# Altium project MPPT.PrjPcb
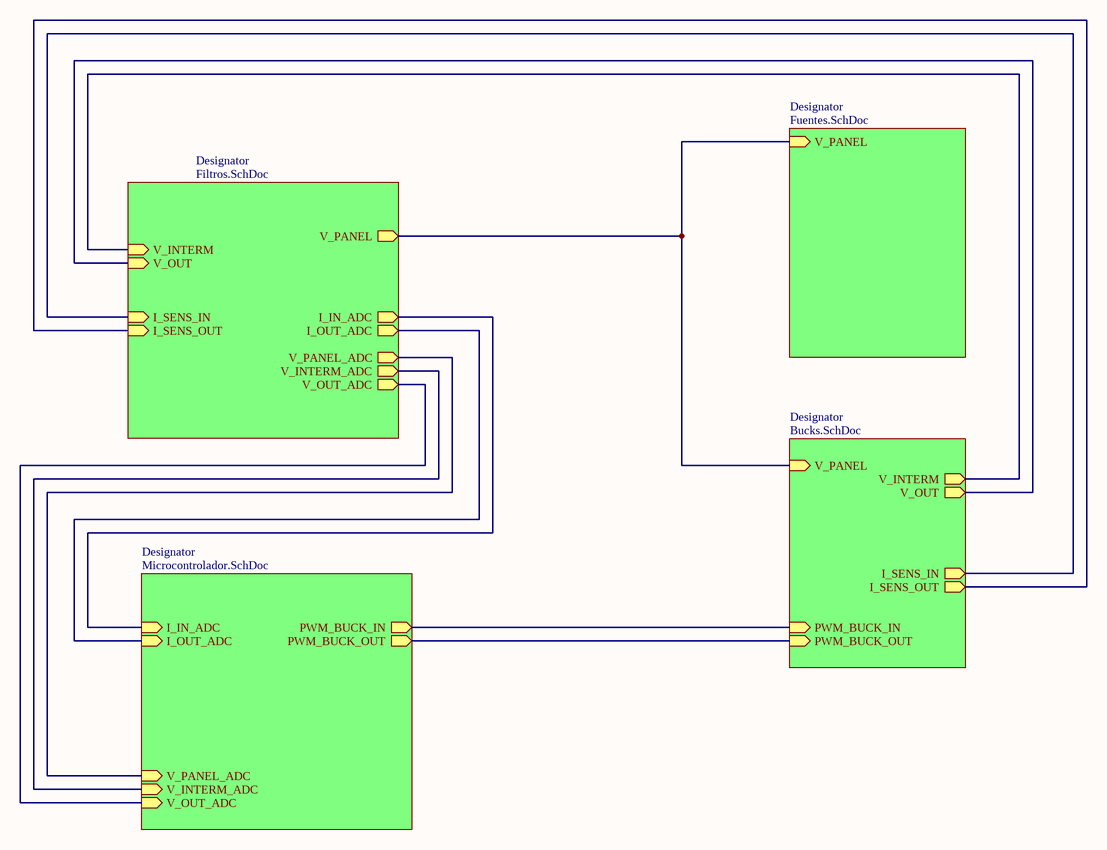
[diagram p0: MainSCH.SchDoc]
5 sheets, 93 parts. Net scope: hierarchical (ports join the sheet entries above them; power ports are global).
Board file: PCB_MPPT_V1.0.PcbDoc
Sheets:
  MainSCH.SchDoc
    Designator = Bucks.SchDoc
    Designator = Filtros.SchDoc
    Designator = Fuentes.SchDoc
    Designator = Microcontrolador.SchDoc

## Sheet MainSCH.SchDoc
size A4; SheetNumber: 1; SheetTotal: 5

### Sub-sheets
Designator = Bucks.SchDoc: V_PANEL (in), V_INTERM (out), PWM_BUCK_OUT (in), PWM_BUCK_IN (in), V_OUT (out), I_SENS_IN (out), I_SENS_OUT (out)
Designator = Filtros.SchDoc: I_SENS_IN (in), I_SENS_OUT (in), V_INTERM (in), V_OUT (in), V_PANEL (out), I_IN_ADC (out), I_OUT_ADC (out), V_PANEL_ADC (out), V_INTERM_ADC (out), V_OUT_ADC (out)
Designator = Fuentes.SchDoc: V_PANEL (in)
Designator = Microcontrolador.SchDoc: I_IN_ADC (in), I_OUT_ADC (in), V_PANEL_ADC (in), V_INTERM_ADC (in), PWM_BUCK_IN (out), PWM_BUCK_OUT (out), V_OUT_ADC (in)

### Nets
V_INTERM: sheet Designator/V_INTERM, sheet Designator/V_INTERM
V_OUT: sheet Designator/V_OUT, sheet Designator/V_OUT
V_PANEL: sheet Designator/V_PANEL, sheet Designator/V_PANEL, sheet Designator/V_PANEL
NetC12_1: sheet Designator/I_IN_ADC, sheet Designator/I_IN_ADC
NetC13_1: sheet Designator/I_OUT_ADC, sheet Designator/I_OUT_ADC
NetC15_1: sheet Designator/V_PANEL_ADC, sheet Designator/V_PANEL_ADC
NetC16_1: sheet Designator/V_INTERM_ADC, sheet Designator/V_INTERM_ADC
NetC17_1: sheet Designator/V_OUT_ADC, sheet Designator/V_OUT_ADC
NetR7_2: sheet Designator/I_SENS_IN, sheet Designator/I_SENS_IN
NetR9_2: sheet Designator/I_SENS_OUT, sheet Designator/I_SENS_OUT
NetR24_1: sheet Designator/PWM_BUCK_IN, sheet Designator/PWM_BUCK_IN
NetR25_1: sheet Designator/PWM_BUCK_OUT, sheet Designator/PWM_BUCK_OUT

## Sheet Bucks.SchDoc
size A4; SheetNumber: 2; SheetTotal: 5
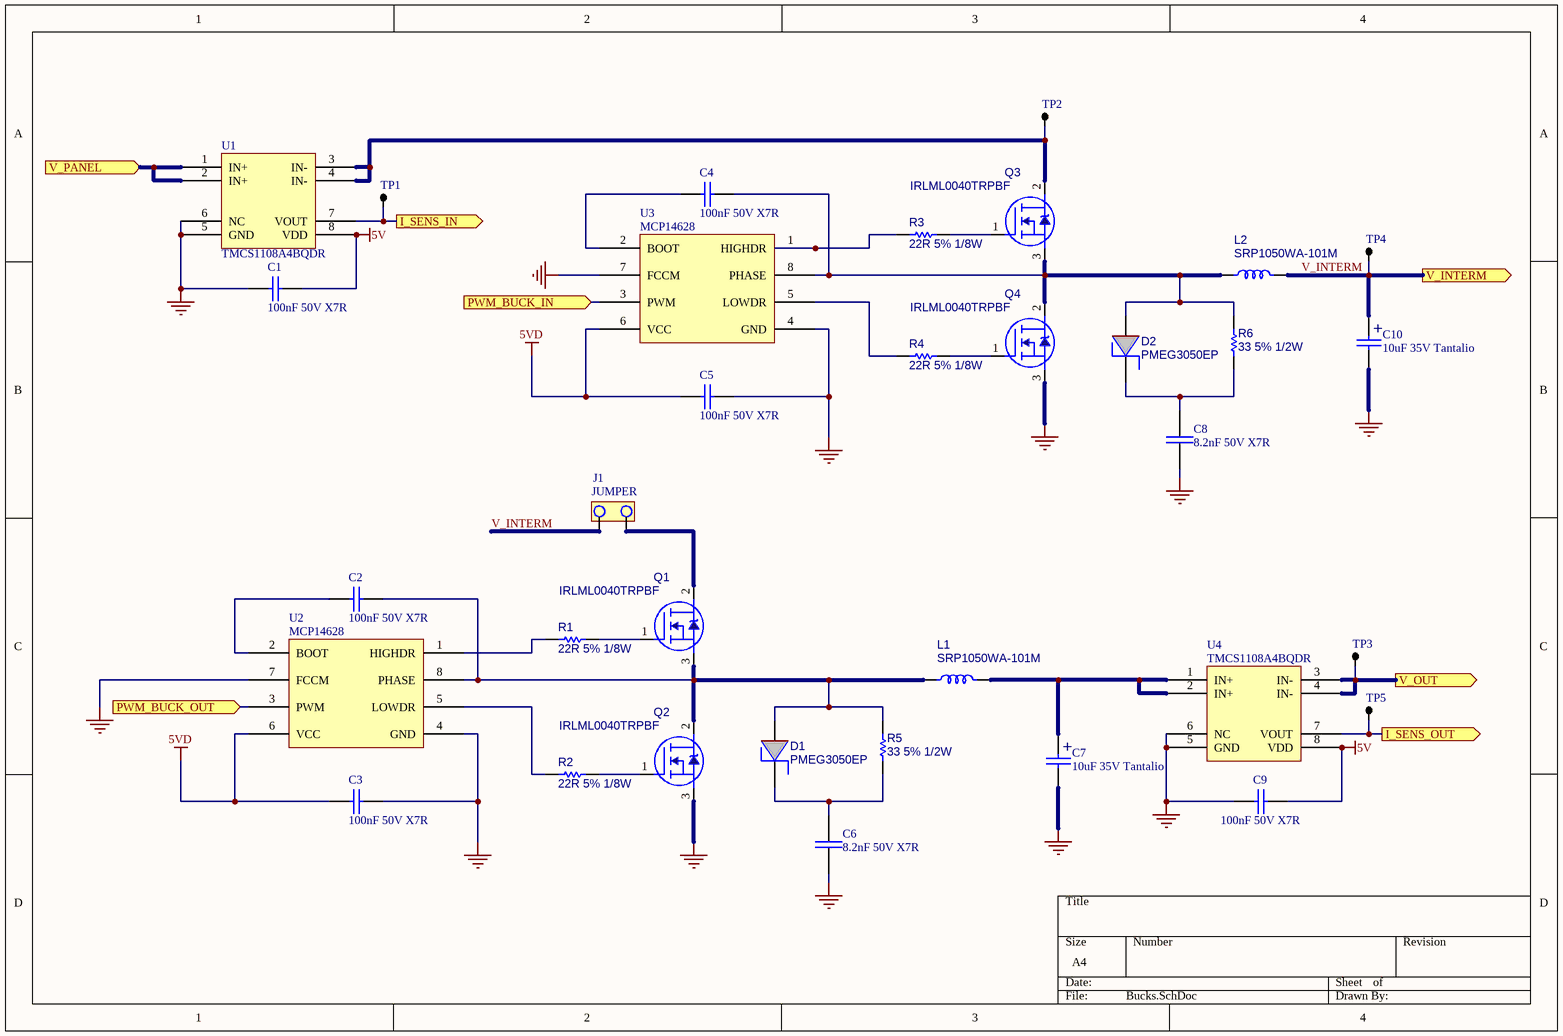
[diagram p1: Bucks.SchDoc]

### Parts
C1  100nF 50V X7R  [0805]
C2  100nF 50V X7R  [0805]
C3  100nF 50V X7R  [0805]
C4  100nF 50V X7R  [0805]
C5  100nF 50V X7R  [0805]
C6  8.2nF 50V X7R  [0805]
C7  10uF 35V Tantalio  [CAPPOL1210]
C8  8.2nF 50V X7R  [0805]
C9  100nF 50V X7R  [0805]
C10  10uF 35V Tantalio  [CAPPOL1210]
D1  PMEG3050EP  [SOD-128]
D2  PMEG3050EP  [SOD-128]
J1  JUMPER  [0805]
L1  SRP1050WA-101M  [SRP1050WA]
L2  SRP1050WA-101M  [SRP1050WA]
Q1  IRLML0040TRPBF  [DPAK]
Q2  IRLML0040TRPBF  [DPAK]
Q3  IRLML0040TRPBF  [DPAK]
Q4  IRLML0040TRPBF  [DPAK]
R1  22R 5% 1/8W  [0805]
R2  22R 5% 1/8W  [0805]
R3  22R 5% 1/8W  [0805]
R4  22R 5% 1/8W  [0805]
R5  33 5% 1/2W  [1206]
R6  33 5% 1/2W  [1206]
TP1  TP  [TP_COMPACT]  (value not drawn)
TP2  TP  [TP_COMPACT]  (value not drawn)
TP3  TP  [TP_COMPACT]  (value not drawn)
TP4  TP  [TP_COMPACT]  (value not drawn)
TP5  TP  [TP_COMPACT]  (value not drawn)
U1  TMCS1108A4BQDR  [SO8]
U2  MCP14628  [SO8]
U3  MCP14628  [SO8]
U4  TMCS1108A4BQDR  [SO8]

### Ports
I_SENS_IN (out, see MainSCH[4C], Filtros[1B]), I_SENS_OUT (out, see MainSCH[4C], Filtros[1C]), PWM_BUCK_IN (in, see MainSCH[3C], Microcontrolador[4A]), PWM_BUCK_OUT (in, see MainSCH[3C], Microcontrolador[4B]), V_INTERM (out, see MainSCH[4C], Filtros[2C]), V_OUT (out, see MainSCH[4C], Filtros[3B]), V_PANEL (in, see MainSCH[3C], Filtros[2A], Fuentes[1B])

### Nets
5V: C1.1 C9.1 U1.8(VDD) U4.8(VDD)
5VD: C3.2 C5.2 U2.6(VCC) U3.6(VCC)
GND: C1.2 C3.1 C5.1 C6.2 C7.2 C8.2 C9.2 C10.2 Q2.3(SOURCE) Q4.3(SOURCE) U1.5(GND) U1.6(NC) U2.4(GND) U2.7(FCCM) U3.4(GND) U3.7(FCCM) U4.5(GND) U4.6(NC)
V_INTERM: C10.1 J1.2 L2.2 TP4.1 ; port V_INTERM
V_OUT: TP3.1 U4.3(IN-) U4.4(IN-) ; port V_OUT
V_PANEL: U1.1(IN+) U1.2(IN+) ; port V_PANEL
NetC2_1: C2.1 D1.1(A) L1.1 Q1.3(SOURCE) Q2.2(DRAIN) R5.2 U2.8(PHASE)
NetC2_2: C2.2 U2.2(BOOT)
NetC4_1: C4.1 D2.1(A) L2.1 Q3.3(SOURCE) Q4.2(DRAIN) R6.2 U3.8(PHASE)
NetC4_2: C4.2 U3.2(BOOT)
NetC6_1: C6.1 D1.2(K) R5.1
NetC7_1: C7.1 L1.2 U4.1(IN+) U4.2(IN+)
NetC8_1: C8.1 D2.2(K) R6.1
NetJ1_1: J1.1 Q1.2(DRAIN)
NetQ1_1: Q1.1(GATE) R1.1
NetQ2_1: Q2.1(GATE) R2.1
NetQ3_1: Q3.1(GATE) R3.1
NetQ3_2: Q3.2(DRAIN) TP2.1 U1.3(IN-) U1.4(IN-)
NetQ4_1: Q4.1(GATE) R4.1
NetR1_2: R1.2 U2.1(HIGHDR)
NetR2_2: R2.2 U2.5(LOWDR)
NetR3_2: R3.2 U3.1(HIGHDR)
NetR4_2: R4.2 U3.5(LOWDR)
NetR7_2: TP1.1 U1.7(VOUT) ; port I_SENS_IN
NetR9_2: TP5.1 U4.7(VOUT) ; port I_SENS_OUT
NetR24_1: U3.3(PWM) ; port PWM_BUCK_IN
NetR25_1: U2.3(PWM) ; port PWM_BUCK_OUT

### Notes on the sheet
- (in symbol CAPPOL) +

### Library data of the parts
C1-C5 C9 = CAP
C6 C8 = Ceramic capacitor
C7 C10 = CAPPOL: TCJB106M035R0200
D1 D2 = DIODO_SH: Diode Shottky
L1 L2 = IND: Inductor
Q1-Q4 = N_MOSFET_SOT23: Mosfet N-Ch
R1-R6 = Res1: Resistor
U1 U4 = TMCS1108: Supplier 1: Digi-Key; Supplier Part Number 1: 296-TMCS1108A4BQDRCT-ND

## Sheet Filtros.SchDoc: Electronica de Potencia
size A4; CompanyName: UTN FRBA; SheetNumber: 3; SheetTotal: 5
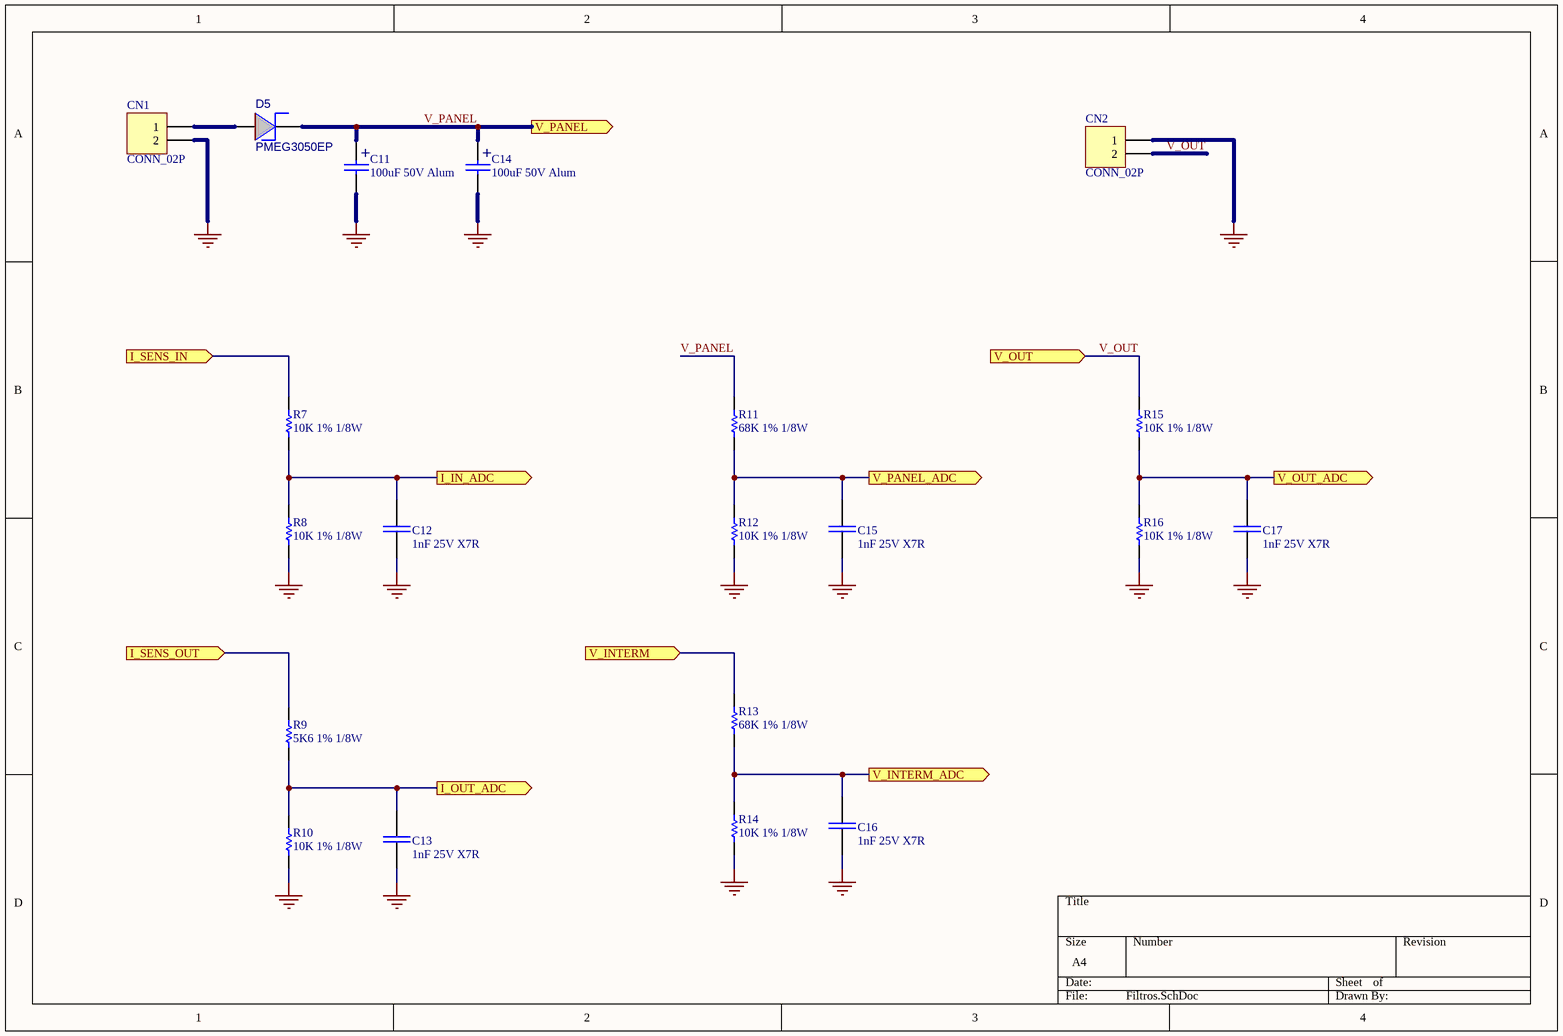
[diagram p2: Filtros.SchDoc]

### Parts
C11  100uF 50V Alum  [CAPSMD8x8.3]
C12  1nF 25V X7R  [0805]
C13  1nF 25V X7R  [0805]
C14  100uF 50V Alum  [CAPSMD8x8.3]
C15  1nF 25V X7R  [0805]
C16  1nF 25V X7R  [0805]
C17  1nF 25V X7R  [0805]
CN1  CONN_02P  [Bornera2_DegsonH]
CN2  CONN_02P  [Bornera2_DegsonH]
D5  PMEG3050EP  [SOD-128]
R7  10K 1% 1/8W  [0805]
R8  10K 1% 1/8W  [0805]
R9  5K6 1% 1/8W  [0805]
R10  10K 1% 1/8W  [0805]
R11  68K 1% 1/8W  [0805]
R12  10K 1% 1/8W  [0805]
R13  68K 1% 1/8W  [0805]
R14  10K 1% 1/8W  [0805]
R15  10K 1% 1/8W  [0805]
R16  10K 1% 1/8W  [0805]

### Ports
I_IN_ADC (out, see MainSCH[2B], Microcontrolador[3A]), I_OUT_ADC (out, see MainSCH[2B], Microcontrolador[3A]), I_SENS_IN (in, see MainSCH[2B], Bucks[2A]), I_SENS_OUT (in, see MainSCH[2B], Bucks[4C]), V_INTERM (in, see MainSCH[2B], Bucks[4B]), V_INTERM_ADC (out, see MainSCH[2B], Microcontrolador[3A]), V_OUT (in, see MainSCH[2B], Bucks[4C]), V_OUT_ADC (out, see MainSCH[2B], Microcontrolador[3A]), V_PANEL (out, see MainSCH[2B], Bucks[1A], Fuentes[1B]), V_PANEL_ADC (out, see MainSCH[2B], Microcontrolador[3A])

### Nets
GND: C11.2 C12.2 C13.2 C14.2 C15.2 C16.2 C17.2 CN1.2 CN2.1 R8.1 R10.1 R12.1 R14.1 R16.1
V_INTERM: R13.2 ; port V_INTERM
V_OUT: CN2.2 R15.2 ; port V_OUT
V_PANEL: C11.1 C14.1 D5.2(K) R11.2 ; port V_PANEL
NetC12_1: C12.1 R7.1 R8.2 ; port I_IN_ADC
NetC13_1: C13.1 R9.1 R10.2 ; port I_OUT_ADC
NetC15_1: C15.1 R11.1 R12.2 ; port V_PANEL_ADC
NetC16_1: C16.1 R13.1 R14.2 ; port V_INTERM_ADC
NetC17_1: C17.1 R15.1 R16.2 ; port V_OUT_ADC
NetCN1_1: CN1.1 D5.1(A)
NetR7_2: R7.2 ; port I_SENS_IN
NetR9_2: R9.2 ; port I_SENS_OUT

### Notes on the sheet
- (in symbol CAPPOL) +

### Library data of the parts
C11 C14 = CAPPOL: UWZ1H101MCL1GS
C12 C13 C15-C17 = Ceramic capacitor
CN1 CN2 = CONN_02P: Connector Generic 2 Vias
D5 = DIODO_SH: Diode Shottky
R7-R16 = RES

## Sheet Fuentes.SchDoc
size A4; SheetNumber: 5; SheetTotal: 5
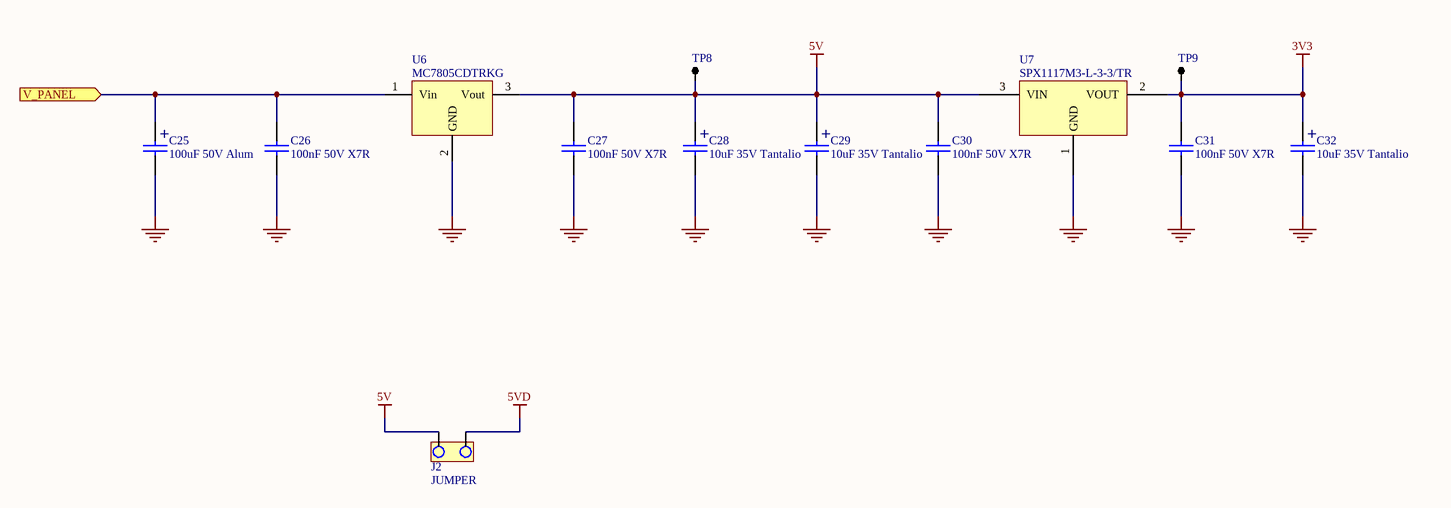
[diagram p3: Fuentes.SchDoc]

### Parts
C25  100uF 50V Alum  [CAPSMD8x8.3]
C26  100nF 50V X7R  [0805]
C27  100nF 50V X7R  [0805]
C28  10uF 35V Tantalio  [CAPPOL1210]
C29  10uF 35V Tantalio  [CAPPOL1210]
C30  100nF 50V X7R  [0805]
C31  100nF 50V X7R  [0805]
C32  10uF 35V Tantalio  [CAPPOL1210]
J2  JUMPER  [0805]
TP8  TP  [TP_COMPACT]  (value not drawn)
TP9  TP  [TP_COMPACT]  (value not drawn)
U6  MC7805CDTRKG  [dpak]
U7  SPX1117M3-L-3-3/TR  [SOT223]

### Ports
V_PANEL (in, see MainSCH[3A], Bucks[1A], Filtros[2A])

### Nets
3V3: C31.1 C32.1 TP9.1 U7.2(VOUT)
5V: C27.1 C28.1 C29.1 C30.2 J2.1 TP8.1 U6.3(Vout) U7.3(VIN)
5VD: J2.2
GND: C25.2 C26.2 C27.2 C28.2 C29.2 C30.1 C31.2 C32.2 U6.2(GND) U7.1(GND)
V_PANEL: C25.1 C26.1 U6.1(Vin) ; port V_PANEL

### Notes on the sheet
- (in symbol CAPPOL) +

### Library data of the parts
C25 = CAPPOL: UWZ1H101MCL1GS
C26 C27 C30 C31 = CAP
C28 C29 C32 = CAPPOL: TCJB106M035R0200
U6 = LM78XX
U7 = LIN_REG

## Sheet Microcontrolador.SchDoc
size A4; SheetNumber: 4; SheetTotal: 5
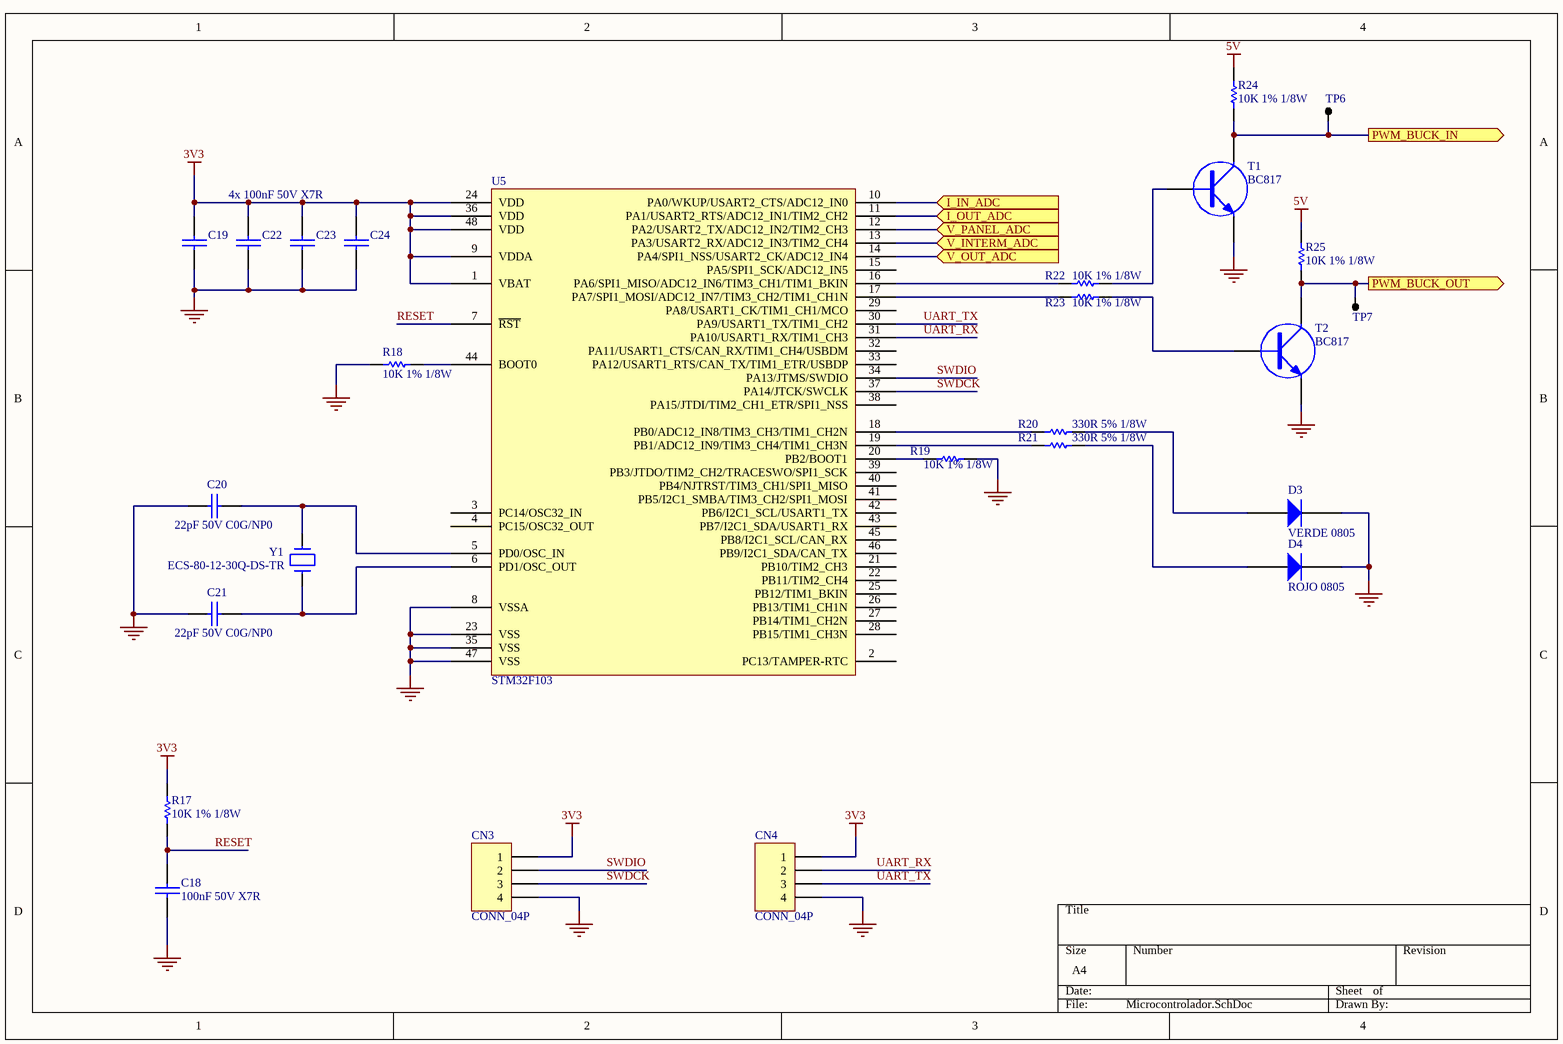
[diagram p4: Microcontrolador.SchDoc]

### Parts
C18  100nF 50V X7R  [0805]
C19  100nF 50V X7R  [0805]  (value not drawn)
C20  22pF 50V C0G/NP0  [0805]
C21  22pF 50V C0G/NP0  [0805]
C22  100nF 50V X7R  [0805]  (value not drawn)
C23  100nF 50V X7R  [0805]  (value not drawn)
C24  100nF 50V X7R  [0805]  (value not drawn)
CN3  CONN_04P  [MOLEX4 - 0.1"]
CN4  CONN_04P  [MOLEX4 - 0.1"]
D3  VERDE 0805  [LED0805]
D4  ROJO 0805  [LED0805]
R17  10K 1% 1/8W  [0805]
R18  10K 1% 1/8W  [0805]
R19  10K 1% 1/8W  [0805]
R20  330R 5% 1/8W  [0805]
R21  330R 5% 1/8W  [0805]
R22  10K 1% 1/8W  [0805]
R23  10K 1% 1/8W  [0805]
R24  10K 1% 1/8W  [0805]
R25  10K 1% 1/8W  [0805]
T1  BC817  [SOT23]
T2  BC817  [SOT23]
TP6  TP  [TP_COMPACT]  (value not drawn)
TP7  TP  [TP_COMPACT]  (value not drawn)
U5  STM32F103  [LQFP48 - 7x7]
Y1  ECS-80-12-30Q-DS-TR  [ECS 2-SMD]

### Ports
I_IN_ADC (in, see MainSCH[2C], Filtros[2B]), I_OUT_ADC (in, see MainSCH[2C], Filtros[2D]), PWM_BUCK_IN (out, see MainSCH[2C], Bucks[2B]), PWM_BUCK_OUT (out, see MainSCH[2C], Bucks[1C]), V_INTERM_ADC (in, see MainSCH[2D], Filtros[3D]), V_OUT_ADC (in, see MainSCH[2D], Filtros[4B]), V_PANEL_ADC (in, see MainSCH[2D], Filtros[3B])

### Nets
3V3: C19.2 C22.2 C23.2 C24.2 CN3.1 CN4.1 R17.2 U5.1(VBAT) U5.9(VDDA) U5.24(VDD) U5.36(VDD) U5.48(VDD)
5V: R24.2 R25.2
GND: C18.1 C19.1 C20.2 C21.2 C22.1 C23.1 C24.1 CN3.4 CN4.4 D3.K D4.K R18.1 R19.2 T1.3(E) T2.3(E) U5.8(VSSA) U5.23(VSS) U5.35(VSS) U5.47(VSS)
RESET: C18.2 R17.1 U5.7(~{RST})
SWDCK: CN3.3 U5.37(PA14/JTCK/SWCLK)
SWDIO: CN3.2 U5.34(PA13/JTMS/SWDIO)
UART_RX: CN4.2 U5.31(PA10/USART1_RX/TIM1_CH3)
UART_TX: CN4.3 U5.30(PA9/USART1_TX/TIM1_CH2)
NetC12_1: U5.10(PA0/WKUP/USART2_CTS/ADC12_IN0) ; port I_IN_ADC
NetC13_1: U5.11(PA1/USART2_RTS/ADC12_IN1/TIM2_CH2) ; port I_OUT_ADC
NetC15_1: U5.12(PA2/USART2_TX/ADC12_IN2/TIM2_CH3) ; port V_PANEL_ADC
NetC16_1: U5.13(PA3/USART2_RX/ADC12_IN3/TIM2_CH4) ; port V_INTERM_ADC
NetC17_1: U5.14(PA4/SPI1_NSS/USART2_CK/ADC12_IN4) ; port V_OUT_ADC
NetC20_1: C20.1 U5.5(PD0/OSC_IN) Y1.2
NetC21_1: C21.1 U5.6(PD1/OSC_OUT) Y1.1
NetD3_A: D3.A R20.2
NetD4_A: D4.A R21.2
NetR18_2: R18.2 U5.44(BOOT0)
NetR19_1: R19.1 U5.20(PB2/BOOT1)
NetR20_1: R20.1 U5.18(PB0/ADC12_IN8/TIM3_CH3/TIM1_CH2N)
NetR21_1: R21.1 U5.19(PB1/ADC12_IN9/TIM3_CH4/TIM1_CH3N)
NetR22_1: R22.1 U5.16(PA6/SPI1_MISO/ADC12_IN6/TIM3_CH1/TIM1_BKIN)
NetR22_2: R22.2 T1.1(B)
NetR23_1: R23.1 U5.17(PA7/SPI1_MOSI/ADC12_IN7/TIM3_CH2/TIM1_CH1N)
NetR23_2: R23.2 T2.1(B)
NetR24_1: R24.1 T1.2(C) TP6.1 ; port PWM_BUCK_IN
NetR25_1: R25.1 T2.2(C) TP7.1 ; port PWM_BUCK_OUT

Not connected (* = marked no-connect by the designer): U5 2(PC13/TAMPER-RTC) 3(PC14/OSC32_IN) 4(PC15/OSC32_OUT) 15(PA5/SPI1_SCK/ADC12_IN5) 21(PB10/TIM2_CH3) 22(PB11/TIM2_CH4) 25(PB12/TIM1_BKIN) 26(PB13/TIM1_CH1N) 27(PB14/TIM1_CH2N) 28(PB15/TIM1_CH3N) 29(PA8/USART1_CK/TIM1_CH1/MCO) 32(PA11/USART1_CTS/CAN_RX/TIM1_CH4/USBDM) 33(PA12/USART1_RTS/CAN_TX/TIM1_ETR/USBDP) 38(PA15/JTDI/TIM2_CH1_ETR/SPI1_NSS) 39(PB3/JTDO/TIM2_CH2/TRACESWO/SPI1_SCK) 40(PB4/NJTRST/TIM3_CH1/SPI1_MISO) 41(PB5/I2C1_SMBA/TIM3_CH2/SPI1_MOSI) 42(PB6/I2C1_SCL/USART1_TX) 43(PB7/I2C1_SDA/USART1_RX) 45(PB8/I2C1_SCL/CAN_RX) 46(PB9/I2C1_SDA/CAN_TX)

### Notes on the sheet
- 4x 100nF 50V X7R

### Library data of the parts
C18-C24 = CAP
CN3 CN4 = CONN_04P: Connector Generic 4 Vias
D3 D4 = Led
R17-R25 = RES
T1 T2 = TRANSISTOR NPN
Y1 = CRISTAL

## Nets that join several sheets
3V3: Fuentes (C31.1 C32.1 TP9.1 U7.2), Microcontrolador (12 pins)
5V: Bucks (C1.1 C9.1 U1.8 U4.8), Fuentes (8 pins), Microcontrolador (R24.2 R25.2)
5VD: Bucks (C3.2 C5.2 U2.6 U3.6), Fuentes (J2.2)
GND: Bucks (18 pins), Filtros (14 pins), Fuentes (10 pins), Microcontrolador (19 pins)
NetC12_1: Filtros (C12.1 R7.1 R8.2), Microcontrolador (U5.10)
NetC13_1: Filtros (C13.1 R9.1 R10.2), Microcontrolador (U5.11)
NetC15_1: Filtros (C15.1 R11.1 R12.2), Microcontrolador (U5.12)
NetC16_1: Filtros (C16.1 R13.1 R14.2), Microcontrolador (U5.13)
NetC17_1: Filtros (C17.1 R15.1 R16.2), Microcontrolador (U5.14)
NetR7_2: Bucks (TP1.1 U1.7), Filtros (R7.2)
NetR9_2: Bucks (TP5.1 U4.7), Filtros (R9.2)
NetR24_1: Bucks (U3.3), Microcontrolador (R24.1 T1.2 TP6.1)
NetR25_1: Bucks (U2.3), Microcontrolador (R25.1 T2.2 TP7.1)
V_INTERM: Bucks (C10.1 J1.2 L2.2 TP4.1), Filtros (R13.2)
V_OUT: Bucks (TP3.1 U4.3 U4.4), Filtros (CN2.2 R15.2)
V_PANEL: Bucks (U1.1 U1.2), Filtros (C11.1 C14.1 D5.2 R11.2), Fuentes (C25.1 C26.1 U6.1)